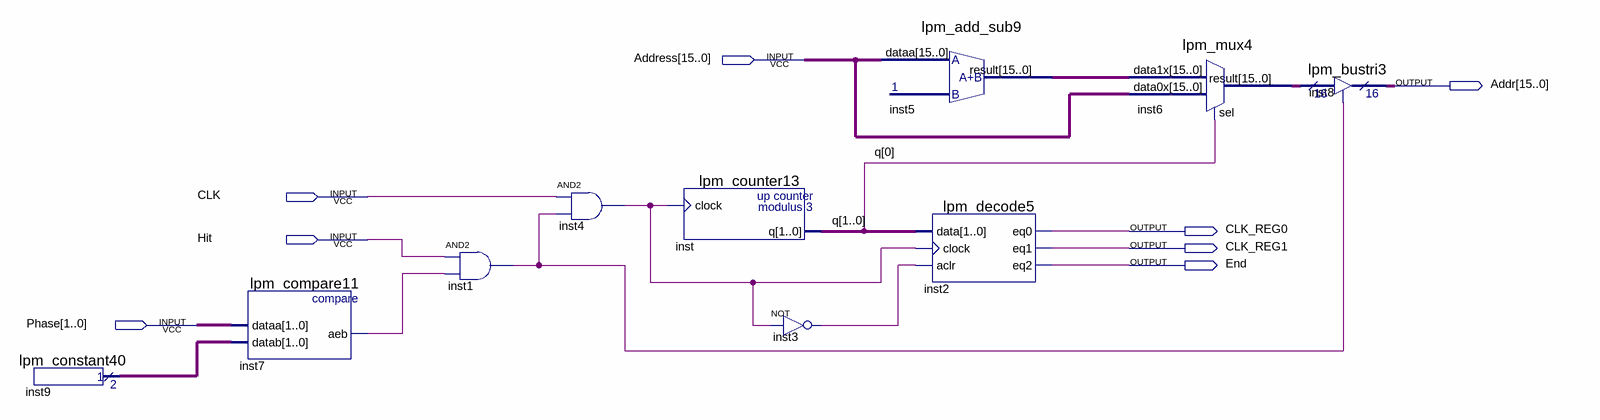
[diagram p0: schematic sheet]
// Quartus schematic LoadToCommandReg.bdf as structural Verilog: 10 symbols, 8 pins
module LoadToCommandReg (
  input  [15:0] Address,
  input  CLK,
  input  Hit,
  input  [1:0] Phase,
  output [15:0] Addr,
  output CLK_REG0,
  output CLK_REG1,
  output End
);

  wire inst1_out, inst3_out, inst4_out, inst7_aeb;
  wire [1:0] inst9_result, q;
  wire [15:0] inst5_result, inst6_result;

  lpm_constant40 inst9 (.result(inst9_result));
  lpm_compare11 inst7 (.dataa(Phase), .datab(inst9_result), .aeb(inst7_aeb));
  and inst1 (inst1_out, Hit, inst7_aeb);
  and inst4 (inst4_out, CLK, inst1_out);
  lpm_counter13 inst (.clock(inst4_out), .q(q));
  not inst3 (inst3_out, inst4_out);
  lpm_add_sub9 inst5 (.dataa(Address), .result(inst5_result));
  lpm_decode5 inst2 (.data(q), .clock(inst4_out), .aclr(inst3_out), .eq0(CLK_REG0), .eq1(CLK_REG1), .eq2(End));
  lpm_mux4 inst6 (.data1x(inst5_result), .data0x(Address), .sel(q[0]), .result(inst6_result));
  lpm_bustri3 inst8 (.enabledt(inst1_out), .data(inst6_result), .tridata(Addr));
endmodule
